# EasyEDA schematic Nodemcu Zeno Version_2021-05-12.json
TITLE: Sheet_1; REV: 1.0; Date: 2021-05-09; Sheet: 1/1; Drawn By: Sreeram AJ; Company: Your Company
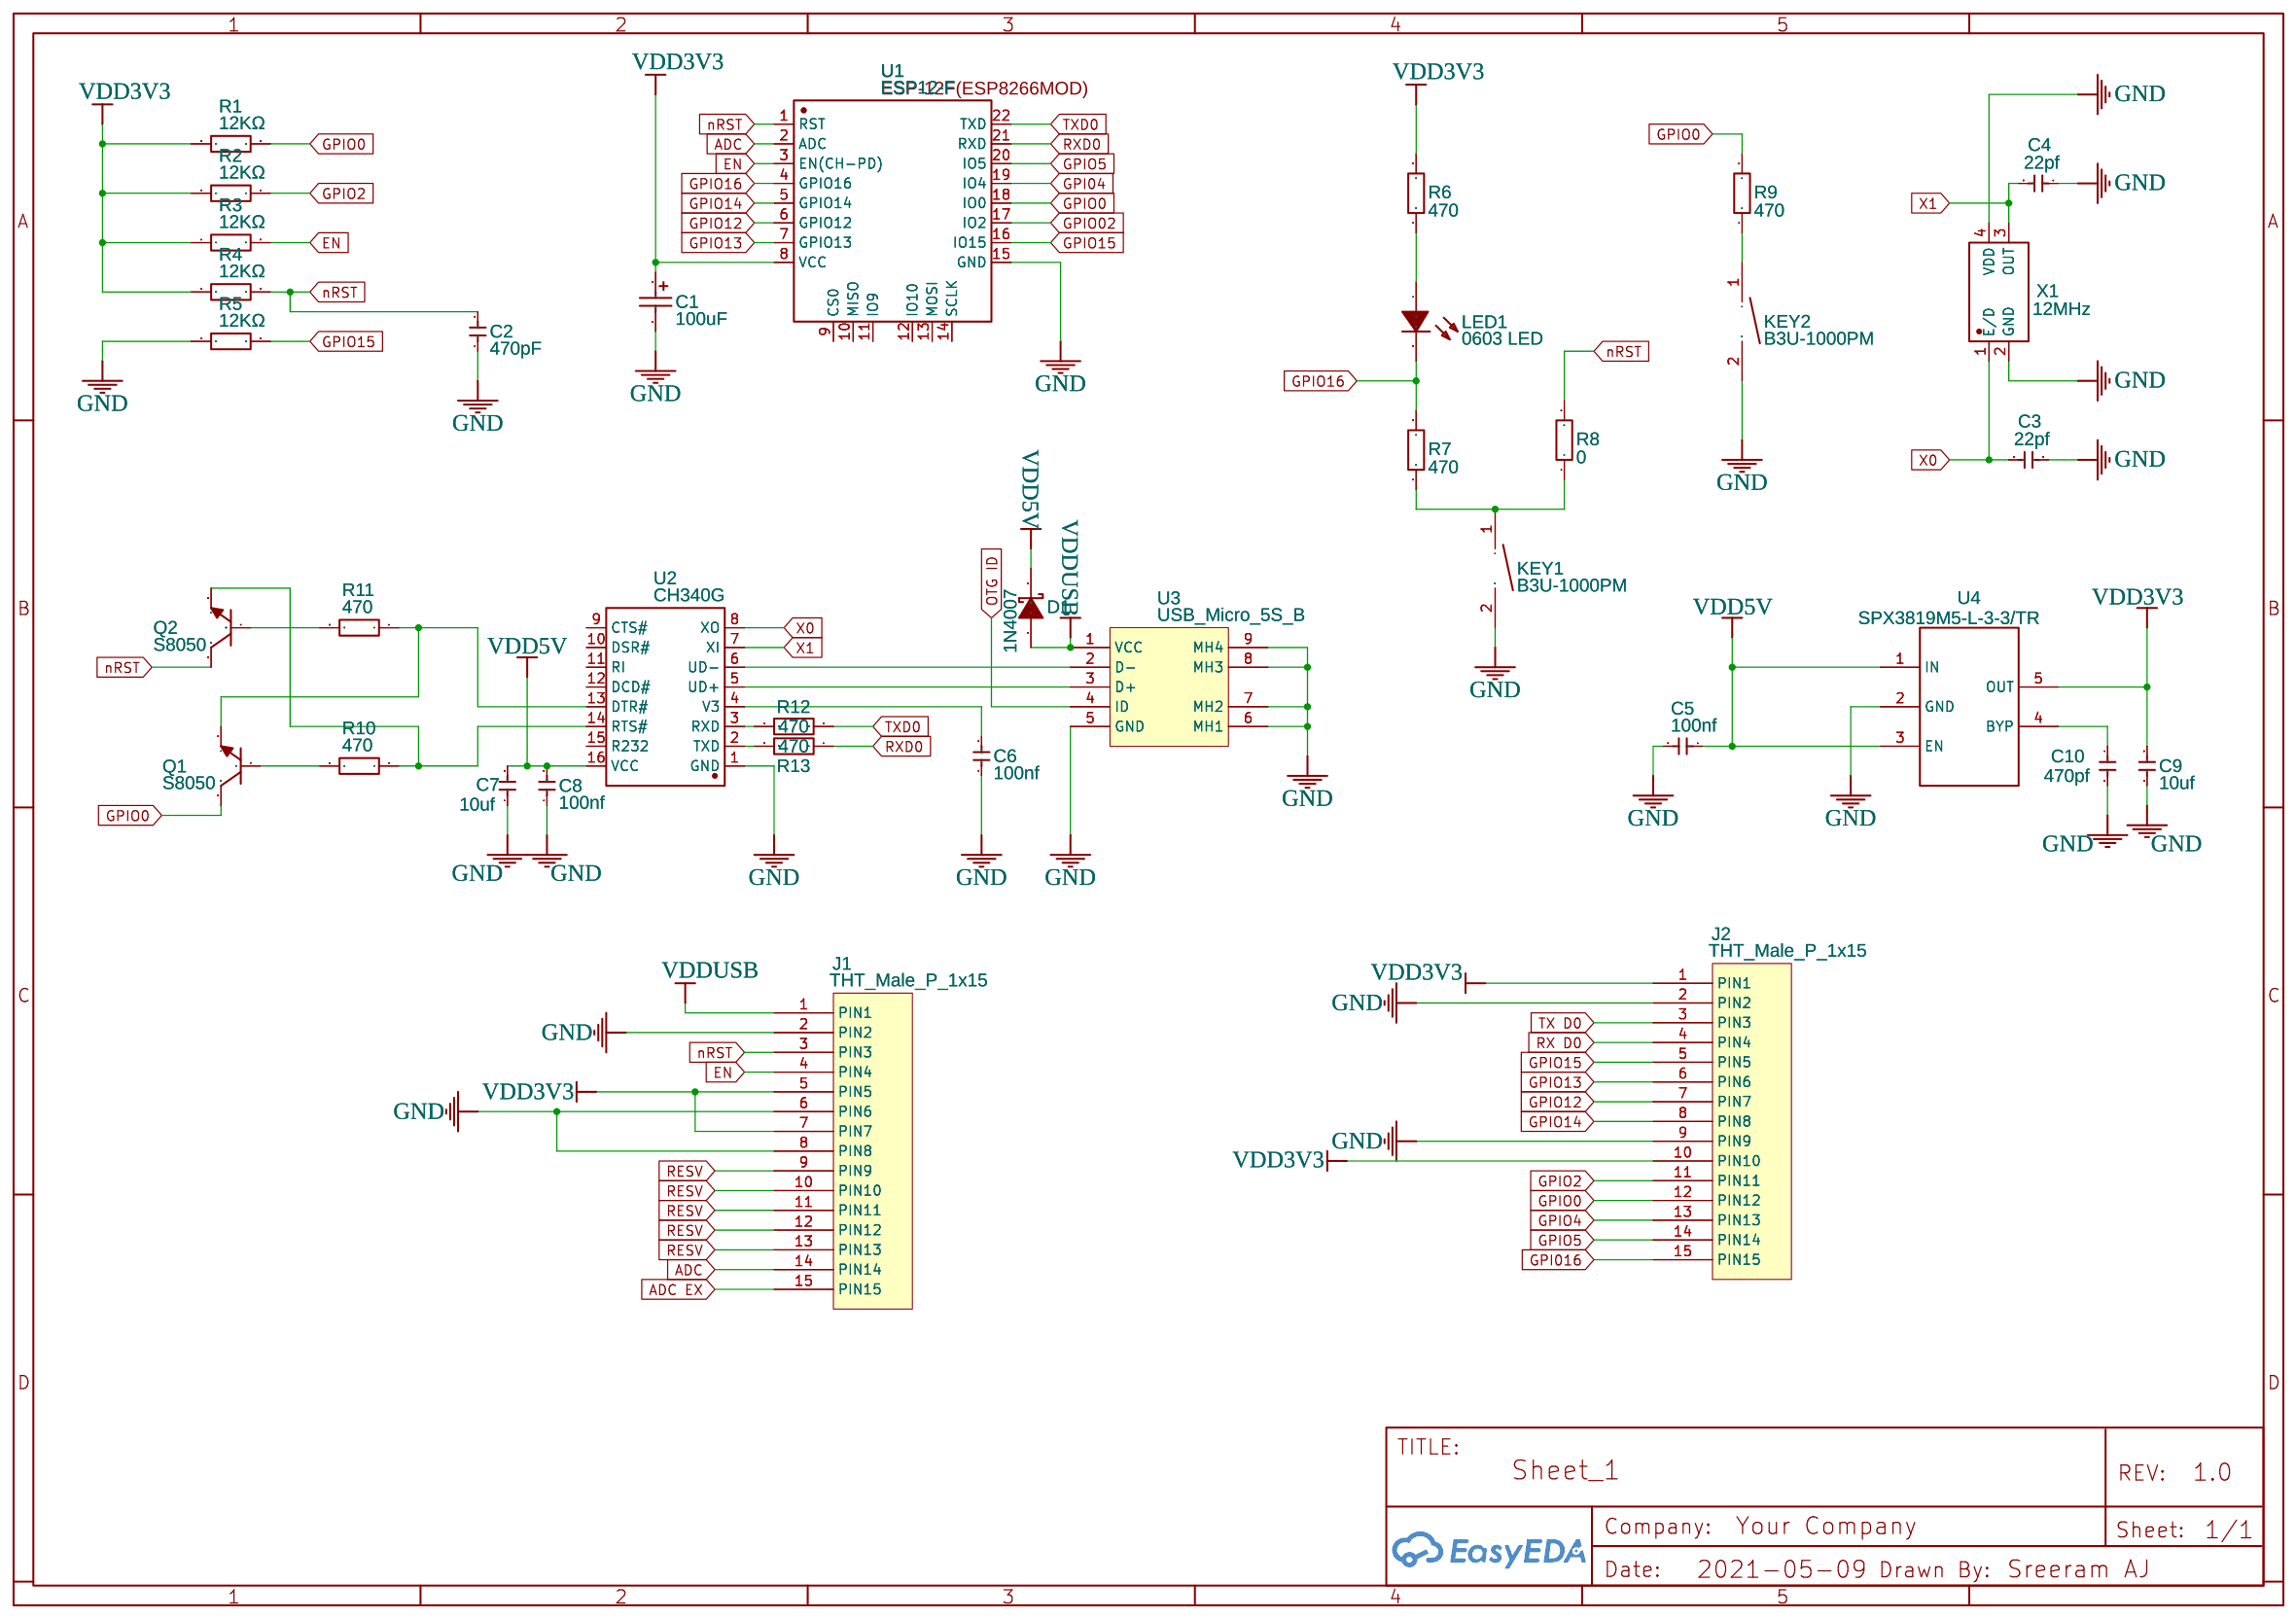
[diagram p0: schematic sheet]

## Parts
C1  100uF  [CAP-SMD_L3.5-W2.8]
C2  470pF  [C0805]
C3  22pf  [C0805]
C4  22pf  [C0805]
C5  100nf  [C0805]
C6  100nf  [C0805]
C7  10uf  [C0805]
C8  100nf  [C0805]
C9  10uf  [C0805]
C10  470pf  [C0805]
D1  1N4007  [DO-214AC_L4.3-W2.7-LS5.3-RD]
J1  THT_Male_P_1x15  [THT_MALE_P_1X15-2.54MM]
J2  THT_Male_P_1x15  [THT_MALE_P_1X15-2.54MM]
KEY1  B3U-1000PM  [KEY-SMD_B3U-1000PM]
KEY2  B3U-1000PM  [KEY-SMD_B3U-1000PM]
LED1  0603 LED  [0603 LED WITH GND SYMBOL]
Q1  S8050  [SOT-23-3_L2.9-W1.3-P1.90-LS2.4-BR]
Q2  S8050  [SOT-23-3_L2.9-W1.3-P1.90-LS2.4-BR]
R1  12KΩ  [0603]
R2  12KΩ  [0603]
R3  12KΩ  [0603]
R4  12KΩ  [0603]
R5  12KΩ  [0603]
R6  470  [0603]
R7  470  [0603]
R8  0  [0603]
R9  470  [0603]
R10  470  [0603]
R11  470  [0603]
R12  470  [0603]
R13  470  [0603]
U1  ESP12-F  [ESP12-F]
U2  CH340G  [SOIC-16_L9.9-W3.9-P1.27-LS6.0-TL]
U3  USB_Micro_5S_B  [USB_MICRO_5S_B]
U4  SPX3819M5-L-3-3/TR  [SOT-23-5_L3.0-W1.7-P0.95-LS2.8-TL]
X1  12MHz  [OSC-SMD_4P-L1.6-W1.2-BL]

## Library data of the parts
C1 = TAJB107M006RNJ: Supplier: LCSC; Manufacturer: AVX; Supplier Part: C7195; LCSC Assembly: Yes; SMT Type: Extend
C2-C10 = 470pF: SMD CAP Ceramic 4.7uF-25V-10%-X5R;0805
D1 = SS310_C85658: Supplier: LCSC; Manufacturer: DYELEC; Manufacturer Part: SS310; image: //image.lceda.cn/szlcsc/C85658.jpg; Supplier Part: C85658; JLCPCB Part Class: Extended Part
J1 J2 = THT_Male_P_1x15: Contributor: Adam Emtorp
KEY1 KEY2 = B3U-1000PM: Supplier: LCSC; Supplier Part: C271754; Manufacturer: Omron Electronics; Contributor: LCSC
LED1 = 0603 LED: Supplier: LCSC; Supplier Part: C375445; Manufacturer: EKINGLUX; Manufacturer Part: E6C0603UYAC1UDA; Contributor: LCSC
Q1 Q2 = S8050: Supplier: LCSC; Supplier Part: C916390; Manufacturer: JSMSEMI; Contributor: LCSC; JLCPCB Part Class: Extended Part
R1-R13 = 12K Resistor SMD 0603 (C22790): Supplier Part: C22790; Supplier: LCSC; Manufacturer: UniOhm; Manufacturer Part: 0603WAF1202T5E; LCSC Assembly: Yes
U1 = ESP12-F: Contributor: mrilic66
U2 = CH340G: Supplier: LCSC; Manufacturer: WCH; image: //image.lceda.cn/szlcsc/C14267.jpg; Supplier Part: C14267; JLCPCB Part Class: Basic Part
U3 = USB_Micro_5S_B: Contributor: Adam Emtorp
U4 = SPX3819M5-L-3-3/TR: Supplier: LCSC; Manufacturer: EXAR; image: //image.lceda.cn/szlcsc/C9055.jpg; Supplier Part: C9055; JLCPCB Part Class: Extended Part
X1 = O705012MGDA4SC: Supplier: LCSC; Manufacturer: YXC; Supplier Part: C70633; JLCPCB Part Class: Extended Part

## Nets
GND: C1.2 C2.1 C3.1 C4.1 C5.2 C6.1 C7.1 C8.1 C9.1 C10.2 J1.2(PIN2) J1.6(PIN6) J1.8(PIN8) J2.2(PIN2) J2.9(PIN9) KEY1.2 KEY2.2 R5.1 U1.15(GND) U2.1(GND) U3.5(GND) U3.6(MH1) U3.7(MH2) U3.8(MH3) U3.9(MH4) U4.2(GND) X1.2(GND) X1.4(VDD)
VDD3V3: C1.1 C9.2 J1.5(PIN5) J1.7(PIN7) J2.1(PIN1) J2.10(PIN10) R1.1 R2.1 R3.1 R4.1 R6.2 U1.8(VCC) U4.5(OUT)
VDD5V: C5.1 C7.2 C8.2 D1.1(K) U2.16(VCC) U4.1(IN) U4.3(EN)
VDDUSB: D1.2(A) J1.1(PIN1) U3.1(VCC)
ADC: J1.14(PIN14) U1.2(ADC)
ADC EX: J1.15(PIN15)
EN: J1.4(PIN4) R3.2 U1.3(EN(CH-PD))
GPI04: U1.19(IO4)
GPI016: J2.15(PIN15)
GPIO0: J2.12(PIN12) Q1.3(C) R1.2 R9.2 U1.18(IO0)
GPIO02: U1.17(IO2)
GPIO2: J2.11(PIN11) R2.2
GPIO4: J2.13(PIN13)
GPIO5: J2.14(PIN14) U1.20(IO5)
GPIO12: J2.7(PIN7) U1.6(GPIO12)
GPIO13: J2.6(PIN6) U1.7(GPIO13)
GPIO14: J2.8(PIN8) U1.5(GPIO14)
GPIO15: J2.5(PIN5) R5.2 U1.16(IO15)
GPIO16: LED1.2(-) R7.2 U1.4(GPIO16)
nRST: C2.2 J1.3(PIN3) Q2.3(C) R4.2 R8.2 U1.1(RST)
OTG ID: U3.4(ID)
RESV: J1.9(PIN9) J1.10(PIN10) J1.11(PIN11) J1.12(PIN12) J1.13(PIN13)
RX D0: J2.4(PIN4)
RXD0: R13.1 U1.21(RXD)
TX D0: J2.3(PIN3)
TXD0: R12.2 U1.22(TXD)
X0: C3.2 U2.8(XO) X1.1(E/D)
X1: C4.2 U2.7(XI) X1.3(OUT)
Net-(C6-2): C6.2 U2.4(V3)
Net-(C10-1): C10.1 U4.4(BYP)
Net-(KEY1-1): KEY1.1 R7.1 R8.1
Net-(KEY2-1): KEY2.1 R9.1
Net-(LED1-1): LED1.1(+) R6.1
Net-(Q1-1): Q1.1(B) R10.2
Net-(Q1-2): Q1.2(E) R11.1 U2.13(DTR#)
Net-(Q2-1): Q2.1(B) R11.2
Net-(Q2-2): Q2.2(E) R10.1 U2.14(RTS#)
Net-(R12-1): R12.1 U2.3(RXD)
Net-(R13-2): R13.2 U2.2(TXD)
Net-(U2-5): U2.5(UD+) U3.3(D+)
Net-(U2-6): U2.6(UD-) U3.2(D-)

Not connected (* = marked no-connect by the designer): U1 9(CS0) 10(MISO) 11(IO9) 12(IO10) 13(MOSI) 14(SCLK); U2 9(CTS#) 10(DSR#) 11(RI) 12(DCD#) 15(R232)
